# Altium schematic sheet Power.SchDoc
size A3; SheetNumber: 5; SheetTotal: 5
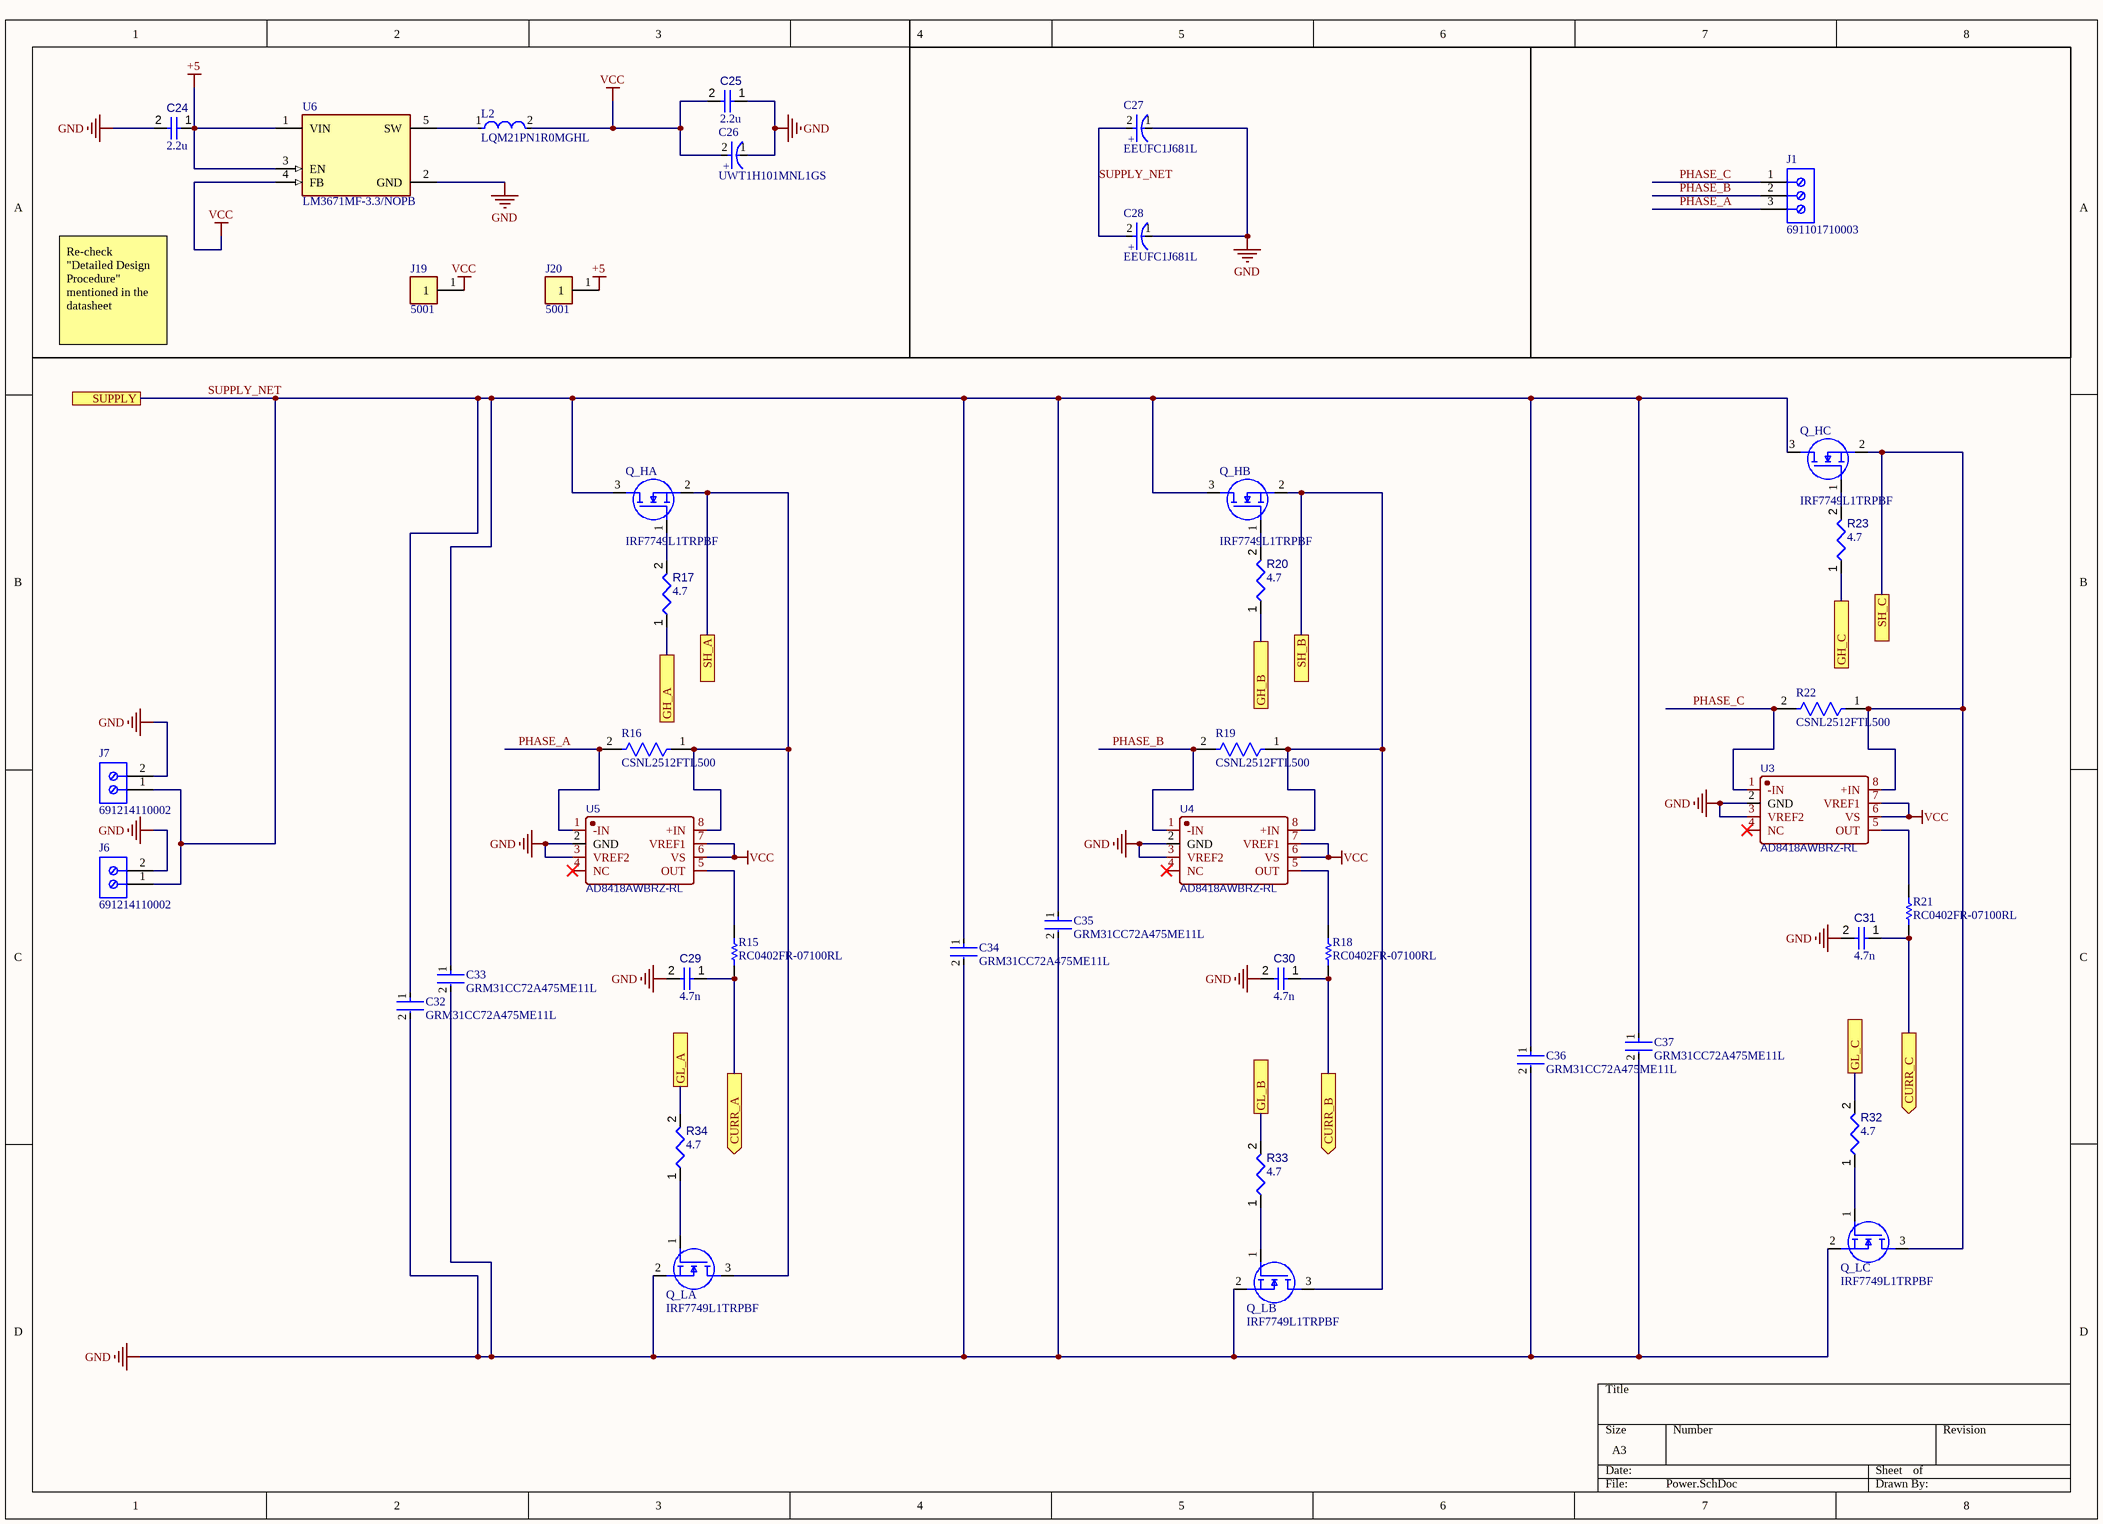
[diagram p0: Power.SchDoc]

## Parts
C24  value 2.2u  [CAP-0805]  (hidden comment: C0805C225J4REC7800)
C25  value 2.2u  [CAP-0805]  (hidden comment: C0805C225J4REC7800)
C26  UWT1H101MNL1GS  [FP-UWT1H101MNL1GS-MFG]
C27  EEUFC1J681L  [FP-EEUFC1J681L-MFG]
C28  EEUFC1J681L  [FP-EEUFC1J681L-MFG]
C29  value 4.7n  [CAP-0402]  (hidden comment: C0402C472K4RECAUTO)
C30  value 4.7n  [CAP-0402]  (hidden comment: C0402C472K4RECAUTO)
C31  value 4.7n  [CAP-0402]  (hidden comment: C0402C472K4RECAUTO)
C32  GRM31CC72A475ME11L  [FP-GRM31C-0_3-e0_3_0_9-MFG]
C33  GRM31CC72A475ME11L  [FP-GRM31C-0_3-e0_3_0_9-MFG]
C34  GRM31CC72A475ME11L  [FP-GRM31C-0_3-e0_3_0_9-MFG]
C35  GRM31CC72A475ME11L  [FP-GRM31C-0_3-e0_3_0_9-MFG]
C36  GRM31CC72A475ME11L  [FP-GRM31C-0_3-e0_3_0_9-MFG]
C37  GRM31CC72A475ME11L  [FP-GRM31C-0_3-e0_3_0_9-MFG]
J1  691101710003  [691101710003]
J6  691214110002  [691214110002]
J7  691214110002  [691214110002]
J19  5001  [FP-5001-MFG]
J20  5001  [FP-5001-MFG]
L2  LQM21PN1R0MGHL  [FP-LQM21PH_G0-MFG]
Q_HA  IRF7749L1TRPBF  [IC-MOSFET-DirectFET]
Q_HB  IRF7749L1TRPBF  [IC-MOSFET-DirectFET]
Q_HC  IRF7749L1TRPBF  [IC-MOSFET-DirectFET]
Q_LA  IRF7749L1TRPBF  [IC-MOSFET-DirectFET]
Q_LB  IRF7749L1TRPBF  [IC-MOSFET-DirectFET]
Q_LC  IRF7749L1TRPBF  [IC-MOSFET-DirectFET]
R15  RC0402FR-07100RL  [RESC1005X40X25ML05T10]
R16  CSNL2512FTL500  [FP-CSNL2512FTL500-MFG]
R17  value 4.7  [RES-0603]  (hidden comment: CRCW06034R70JNEAHP)
R18  RC0402FR-07100RL  [RESC1005X40X25ML05T10]
R19  CSNL2512FTL500  [FP-CSNL2512FTL500-MFG]
R20  value 4.7  [RES-0603]  (hidden comment: CRCW06034R70JNEAHP)
R21  RC0402FR-07100RL  [RESC1005X40X25ML05T10]
R22  CSNL2512FTL500  [FP-CSNL2512FTL500-MFG]
R23  value 4.7  [RES-0603]  (hidden comment: CRCW06034R70JNEAHP)
R32  value 4.7  [RES-0603]  (hidden comment: CRCW06034R70JNEAHP)
R33  value 4.7  [RES-0603]  (hidden comment: CRCW06034R70JNEAHP)
R34  value 4.7  [RES-0603]  (hidden comment: CRCW06034R70JNEAHP)
U3  AD8418AWBRZ-RL  [IC-SOIC8]
U4  AD8418AWBRZ-RL  [IC-SOIC8]
U5  AD8418AWBRZ-RL  [IC-SOIC8]
U6  LM3671MF-3.3/NOPB  [FP-DBV0005A-IPC_C]

## Ports
CURR_A (out), CURR_B (out), CURR_C (out), GH_A, GH_B, GH_C, GL_A, GL_B, GL_C, SH_A, SH_B, SH_C, SUPPLY

## Nets
+5: C24.1 J20.1 U6.1(VIN) U6.3(EN)
GND: C24.2 C25.1 C26.1(C) C27.1(C) C28.1(C) C29.2 C30.2 C31.2 C32.2 C33.2 C34.2 C35.2 C36.2 C37.2 J6.2 J7.2 Q_LA.2(S) Q_LB.2(S) Q_LC.2(S) U3.2(GND) U3.3(VREF2) U4.2(GND) U4.3(VREF2) U5.2(GND) U5.3(VREF2) U6.2(GND)
VCC: C25.2 C26.2(A) J19.1 L2.2 U3.6(VS) U3.7(VREF1) U4.6(VS) U4.7(VREF1) U5.6(VS) U5.7(VREF1) U6.4(FB)
CURR_A: C29.1 R15.1 ; port CURR_A
CURR_B: C30.1 R18.1 ; port CURR_B
CURR_C: C31.1 R21.1 ; port CURR_C
GH_A: R17.1 ; port GH_A
GH_B: R20.1 ; port GH_B
GH_C: R23.1 ; port GH_C
GL_A: R34.2 ; port GL_A
GL_B: R33.2 ; port GL_B
GL_C: R32.2 ; port GL_C
PHASE_A: J1.3 R16.2 U5.1(-IN)
PHASE_B: J1.2 R19.2 U4.1(-IN)
PHASE_C: J1.1 R22.2 U3.1(-IN)
SH_A: Q_HA.2(S) Q_LA.3(D) R16.1 U5.8(+IN) ; port SH_A
SH_B: Q_HB.2(S) Q_LB.3(D) R19.1 U4.8(+IN) ; port SH_B
SH_C: Q_HC.2(S) Q_LC.3(D) R22.1 U3.8(+IN) ; port SH_C
SUPPLY_NET: C27.2(A) C28.2(A) C32.1 C33.1 C34.1 C35.1 C36.1 C37.1 J6.1 J7.1 Q_HA.3(D) Q_HB.3(D) Q_HC.3(D) ; port SUPPLY
NetL2_1: L2.1 U6.5(SW)
NetQ_HA_1: Q_HA.1(G) R17.2
NetQ_HB_1: Q_HB.1(G) R20.2
NetQ_HC_1: Q_HC.1(G) R23.2
NetQ_LA_1: Q_LA.1(G) R34.1
NetQ_LB_1: Q_LB.1(G) R33.1
NetQ_LC_1: Q_LC.1(G) R32.1
NetR15_2: R15.2 U5.5(OUT)
NetR18_2: R18.2 U4.5(OUT)
NetR21_2: R21.2 U3.5(OUT)

Not connected (* = marked no-connect by the designer): U3 4(NC)*; U4 4(NC)*; U5 4(NC)*

## Notes on the sheet
- Re-check "Detailed Design Procedure" mentioned in the datasheet
- (in symbol CMP-2000-07373-2) +
- (in symbol CMP-05427-000007-1) +

## Library data of the parts
C24 C25 = CMP-001-00084-1: ESD SMD Comm X7R 0805 (2012Metric) Ceramic Capacitor 0.079Lx0.049W 2.00mmx1.25mm X7R ±5% 2.2muF
C26 = CMP-2000-07373-2: CAP ALUM 100UF 20% 50V SMD; Leakage Current: 3uA; Ripple Current: 140mA; Life (Hours): 1000Hour; Dissipation Factor: 0.14%; Dielectric Material: Aluminium; Termination: SMD/SMT; Tolerance: 20%; Package Quantity: 500; Capacitance: 100uF; Height: 10mm; REACH SVHC: No SVHC; Case/Package: Radial; Series: WT; Diameter: 8mm; Voltage Rating: 50V; Construction: Cylindrical; Length: 10mm; Min Operating Temperature: -55°C; Max Operating Temperature: 105°C; Voltage Rating (DC): 50V; Packaging: Tape and Reel; Voltage: 50V; Mount: Surface Mount; Ripple Current (AC): 140mA; Radiation Hardening: No; Number of Pins: 2; Lead Free: Lead Free; Height - Seated (Max): 0.413inch; RoHS Compliant: Yes
C27 C28 = CMP-05427-000007-1: CAP ALUM 680UF 20% 63V RADIAL; Manufacturer: Panasonic; Ripple Current: 2265mA; Material: Aluminum; Life: 5000Hours; Automotive Grade: Grade 2; Leakage Current: 428.4uA; Dissipation Factor: 8%; ComponentLink2Description: Datasheet; ComponentLink2URL: https://industrial.panasonic.com/cdbs/www-data/pdf/RDF0000/ABA0000C1209.pdf; Temperature: -55°C to +105°C; Ipc Land Pattern Name: CAPRD500W100D1300H3700; Octopart: https://octopart.com/eeu-fc1j681l-panasonic-39478579; Tolerance: 20%; Voltage Rating: 63V; Category: Cap; Device Class L3: Aluminum Electrolytic Capacitors; Device Class L1: Passive Components; Package: 0; Value: 680uF; Mouser Description: Aluminum Electrolytic Capacitors - Leaded 680uF 63V; Height: 37mm; Automotive: Yes; Digikey Description: CAP ALUM 680UF 20% 63V RADIAL; Device Class L2: Capacitors; Temperature Range High: +105°C; Temperature Range Low: -55°C; RoHS: TRUE; Lead Free: Yes; Capacitance: 680uF; Manufacturer Part Number: EEUFC1J681L
C29-C31 = CMP-001-00083-1: Ceramic Capacitor, Multilayer, Ceramic, 16V, 10% +Tol, 10% -Tol, X7R, 15% TC, 0.0047uF, Surface Mount, 0402; RoHS Compliant: Yes; Capacitor Type: Ceramic; Pins: 2
C32-C37 = CMP-06035-061964-2: Chip Multilayer Ceramic Capacitors for General Purpose, 1206, 4.7uF, X7S, 22%, 20%, 100V; RoHS Compliant: Yes
J1 = CMP-1502-03257-2: NexarPartId: 8917705; Voltage Rating: 250V; Current: 16A; Wire Gauge (Min): 14AWG; Pitch: 5.0038mm; Wire Gauge (Max): 26AWG; Number of Positions Per Level: 3; Plating: Steel; Number of Levels: 1; Stripping Length: -7mm; REACH SVHC: Unknown; Width: 16.2mm; Height: 16.4mm; Contact Material: Brass; RoHS: Compliant; Color: Blue; Contact Plating: Tin; Lead Pitch: 5mm; Packaging: Box; Termination: Screw; Number of Contacts: 3; Wire/Cable Gauge: 26AWG; Min Operating Temperature: -40°C; Max Operating Temperature: 105°C; Housing Material: Nylon; Length: 9mm; Voltage: 250V; Mount: Through Hole; Current Rating: 16A; Number of Pins: 3
J6 J7 = CMP-1502-02464-2: NexarPartId: 18818288; Plating: Brass, Steel; Current: 10A; Pitch: 3.5052mm; Number of Levels: 1; Number of Contacts: 2; Wire Gauge (Min): 16AWG; Voltage: 300V; Wire Gauge (Max): 24AWG; Stripping Length: -6mm; Number of Pins: 2; Number of Rows: 1; REACH SVHC: Unknown; RoHS: Compliant; Housing Material: Nylon; Termination: Screw; Mount: Through Hole; Contact Plating: Brass, Tin; Number of Positions Per Level: 2; Color: Blue, Green; Width: 7.9mm; Voltage Rating: 300V; Length: 7.4mm; Current Rating: 10A; Wire/Cable Gauge: 24AWG; Packaging: Box; Max Operating Temperature: 105°C; Lead Pitch: 3.5mm; Height: 8.7mm; Contact Material: Brass; Min Operating Temperature: -40°C
J19 J20 = CMP-2000-05181-2: PC TEST POINT MINIATURE BLACK; Body Material: Bronze; Plating: Silver; Inside Diameter: 1.27mm; Hole Diameter: 1.6mm; Number of Ports: 1; Outside Diameter: 2.54mm; Insulation: Insulated; Insulation Material: Nylon; Mount: Through Hole; RoHS Compliant: Yes; Series: THM; Height: 0.3inch; Termination: Through Hole; Material: Nylon; Packaging: Bulk; Contact Material: Bronze; REACH SVHC: No SVHC; Contact Plating: Silver; Orientation: Straight; Lead Free: Lead Free; Package Quantity: 100; Length: 7.62mm; Flammability Rating: UL94 V-0; Number of Contacts: 1; Diameter: 2.54mm; Housing Color: Black; Color: Black
L2 = CMP-06042-016504-1: Multilayer Type Inductor for Power Lines, 0805 (2012), 1μH, 20%, 0.1Ω, 2A; Saturation Current: 1.1A; Current Rating: 1.7A; Inductance: 1uH; Core Material: Ferrite; Self Resonant Frequency: 60MHz; Shielding: Shielded; DC Resistance (DCR): 100mR; Test Frequency: 1MHz; Length: 0.079inch; Mount: Surface Mount; Case Code (Imperial): 0805; Max DC Current: 1.7A; Packaging: Tape and Reel; Height - Seated (Max): 0.039inch; Case Code (Metric): 2012; Min Operating Temperature: -40°C; Width: 0.049inch; Tolerance: 20%; Height: 0.9mm; Package Quantity: 3000; Lead Free: Lead Free; Case/Package: 0805; RoHS Compliant: Yes; Weight: 0.000194oz; Termination: SMD/SMT; Max Operating Temperature: 85°C
Q_HA Q_HB Q_HC Q_LA Q_LB Q_LC = CMP-013-00039-8: Power Field-Effect Transistor, 375A I(D), 1-Element, N-Channel, Metal-oxide Semiconductor FET; pin to pad: 2>2+3+4+5+6+7+8+9 3>10+11+12+13+14+15; RoHS Compliant: Yes; Max Operating Temperature: 175°C
R15 R18 R21 = CMP-2002-07344-1: Manufacturer: Yageo / Phycomp; Part Number: RC0402FR-07100RL
R16 R19 R22 = CMP-26527-007622-1: RES 500 UOHM 1% 2W 2512; Resistance: 0.5mR; Temperature Coefficient: 50ppm/°C; Tolerance: 1%; Radiation Hardening: No; Case Code (Imperial): 2512; Width: 0.125inch; Depth: 3.18mm; Max Operating Temperature: 170°C; Number of Terminations: 2; Lead Free: Lead Free; Contact Plating: Tin; Size Code: 2512; Packaging: Tape and Reel; Mount: Surface Mount; Case/Package: 2512; Length: 0.25inch; Max Power Dissipation: 2W; Height: 0.057inch; RoHS Compliant: Yes; Series: CSNL; Construction: Rectangular; Features: Moisture Resistant; Resistor Type: Metal Foil; Power Rating: 2W; Min Operating Temperature: -55°C; Case Code (Metric): 6432; Military Standard: Not
R17 R20 R23 R32-R34 = CMP-009-00180-1: Fixed Resistor, Metal Glaze/thick Film, 0.33W, 4.7ohm, 75V, 5% +/-Tol, 200ppm/Cel, Surface Mount, 0603; Power: 250mW; Case/Package: 0603; Max Operating Temperature: 155°C; Pins: 2; Tolerance: 5%; RoHS Compliant: Yes; Min Operating Temperature: -55°C; Mounting Technology: Surface Mount
U3-U5 = AD8418AWBRZ-RL: Manufacturer: Analog Devices; Contributor: LCSC; Supplier: LCSC; Supplier Part: C462197; Manufacturer Part: AD8418AWBRZ-RL; JLCPCB Part Class: Extended Part; spicePre: U; spiceSymbolName: AD8418AWBRZ-RL
U6 = CMP-0063-01132-4: IC REG BUCK 3.3V 600MA SOT23-5; Number of Outputs: 1; Min Supply Voltage: 2.7V; Frequency: 2MHz; Min Output Voltage: 1.1V; Max Supply Voltage: 5.5V; Output Type: Fixed; Switching Frequency: 2.6MHz; Quiescent Current: 16uA; Case/Package: SOT-23; Number of Pins: 5; Lead Free: Lead Free; Min Operating Temperature: -40°C; Length: 2.92mm; Packaging: Tape and Reel; Max Output Current: 600mA; Height: 1.02mm; Max Operating Temperature: 85°C; Mount: Surface Mount; REACH SVHC: No SVHC; Contact Plating: Tin; Output Current: 600mA; Min Input Voltage: 2.7V; RoHS Compliant: Yes; Output Voltage: 3.3V; Package Quantity: 1000; Max Output Voltage: 3.3V; Nominal Output Voltage: 3.3V; Width: 1.6mm; Max Input Voltage: 5.5V; Termination: SMD/SMT